# Altium schematic sheet Heater_Driver.SchDoc
size 297 x 209 mm; SheetNumber: 10; SheetTotal: 11
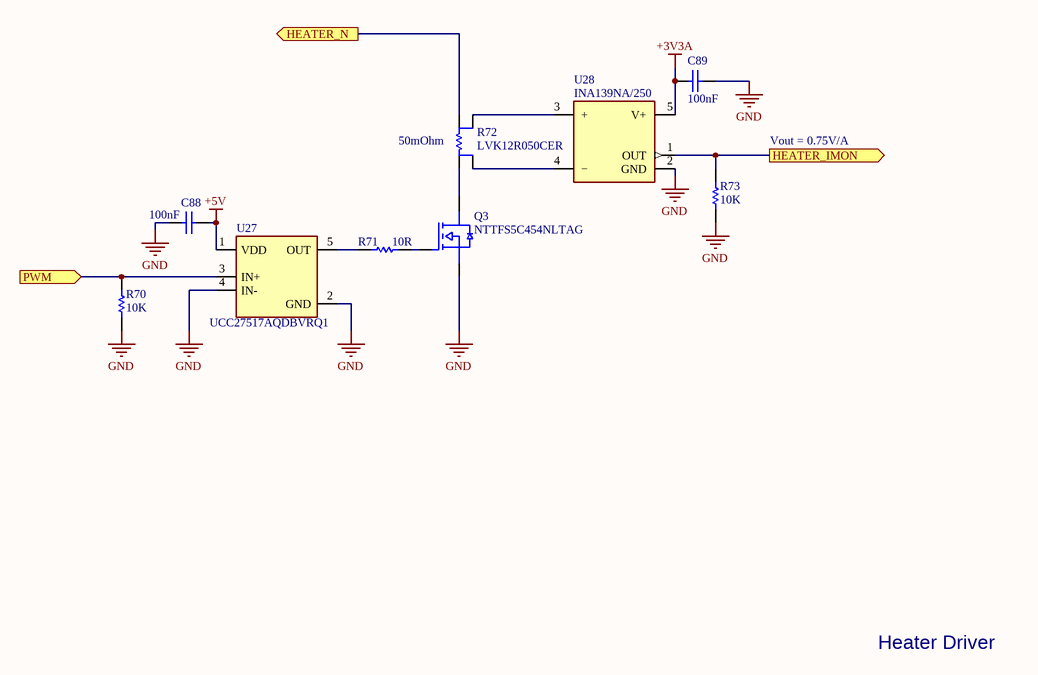
[diagram p0: Heater_Driver.SchDoc]

## Parts
C88  Capacitance: 100nF  [CAPC0603X040]  (hidden comment: C0603C104K5RACTU)
C89  Capacitance: 100nF  [CAPC0603X040]  (hidden comment: C0603C104K5RACTU)
Q3  NTTFS5C454NLTAG  [NTTFS5C454NLTAG]
R70  Resistance: 10K  [RESC0805]  (hidden comment: RMCF0805FT10K0)
R71  Resistance: 10R  [RESC0603]  (hidden comment: RNCF0603AKT10R0)
R72  LVK12R050CER  Resistance: 50mOhm  [LVK12R050CER-2]
R73  Resistance: 10K  [RESC0805]  (hidden comment: RMCF0805FT10K0)
U27  UCC27517AQDBVRQ1  [SOT23-5 IC]
U28  INA139NA/250  [SOT23-5 IC]

## Ports
HEATER_IMON (out, see PDM[2B]), HEATER_N (out, see PDM[1A]), PWM (in, see PDM[2B])

## Nets
+3V3A: C89.2 U28.5(V+)
+5V: C88.2 U27.1(VDD)
GND: C88.1 C89.1 Q3.S R70.1 R73.1 U27.2(GND) U27.4(IN-) U28.2(GND)
HEATER_IMON: R73.2 U28.1(OUT) ; port HEATER_IMON
HEATER_N: R72.1 ; port HEATER_N
PWM: R70.2 U27.3(IN+) ; port PWM
NetQ3_D: Q3.D R72.4
NetQ3_G: Q3.G R71.2
NetR71_1: R71.1 U27.5(OUT)
NetR72_2: R72.2 U28.3(+)
NetR72_3: R72.3 U28.4(−)

## Notes on the sheet
- Vout = 0.75V/A
- Heater Driver
- Size:
- Title:
- A4
- Project:
- Rev:
- Date:
- Drawn By:
- Sheet:
- of

## Library data of the parts
C88 C89 = C0603C104K5RACTU: 0.1 µF ±10% 50V Ceramic Capacitor X7R 0603 (1608 Metric); Tolerance: 10%; Distributor Part Number: 399-C0603C104K5RACTUCT-ND; Case Code: 0603; Voltage Rating: 50V; Distributor: Digikey; Part Number: C0603C104K5RACTU
Q3 = NTTFS5C454NLTAG: N-MOSFET 40 V , 85 A, 3.8 mΩ Rds(on) @ 10 V, WDFN-8 3.3×3.3 mm, low Qg (~18 nC); Manufacturer: Onsemi; Vdss: 40V; Current - Continuous Drain (Id): 20A; Rds On (Max): 3.8mOhm; Gate Charge (Qg) (Max) @ Vgs: 18nC @ 10V; Vgs (Max): 20V; Power Dissipation (Max) (Ta): 3.2W; Part Number: NTTFS5C454NL; Distributor: Digikey; Distributor Part Number: NTTFS5C454NLTAGOSCT-ND; Operating Temperature: -55°C ~ 175°C; ComponentLink1Description: Datasheet; ComponentLink1URL: https://www.onsemi.com/pdf/datasheet/nttfs5c454nl-d.pdf
R70 R73 = RMCF0805FT10K0: 10 kOhms ±1% 0.125W, 1/8W Chip Resistor 0805 (2012 Metric) Automotive AEC-Q200 Thick Film; Tolerance: 1%; Distributor Part Number: RMCF0805FT10K0CT-ND; Case Code: 0805; Distributor: Digikey; Part Number: RMCF0805FT10K0
R71 = RESC0603: 10 Ohms ±0.05% 0.1W, 1/10W Chip Resistor 0603 (1608 Metric) Automotive AEC-Q200 Thin Film; Manufacturer Part Number: RNCF0603AKT10R0; Tolerance: 0.05%; Distributor Part Number: RNCF0603AKT10R0CT-ND; Distributor: Digikey; Case Code: 0603
R72 = LVK12R050CER: Resistor, Current Sense 50 mOhms ±0.25% 0.5W, Moisture Resistant Thick Film; Manufacturer: Ohmite; Temperature Coefficient: ±50ppm/°C; Part Number: LVK12R050CER; Distributor: Digikey; Distributor Part Number: 273-LVK12R050CERCT-ND; Power: 0.5W; Tolerance: 0.25%
U27 = UCC27517AQDBVRQ1: Low-Side Gate Driver IC Inverting, Non-Inverting SOT-23-5; Rise / Fall Time (Typ): 8ns, 7ns; VIL: 1V; VIH: 2.4V; Voltage Supply: 4.5V ~ 18V; Current - Peak Output: 4A; Part Number: UCC27517AQDBVRQ1; Distributor: Digikey; Distributor Part Number: 296-41038-1-ND; Operating Temperature: -40°C ~ 150°C
U28 = INA139NA/250: 40V Current Sense Amplifier 1 Circuit 8-MSOP; Accuracy: 0.5%; Distributor: Digikey; Distributor Part Number: INA139NA/250CT-ND; Operating Temperature: -40°C ~ 125°C; Part Number: INA139NA/250